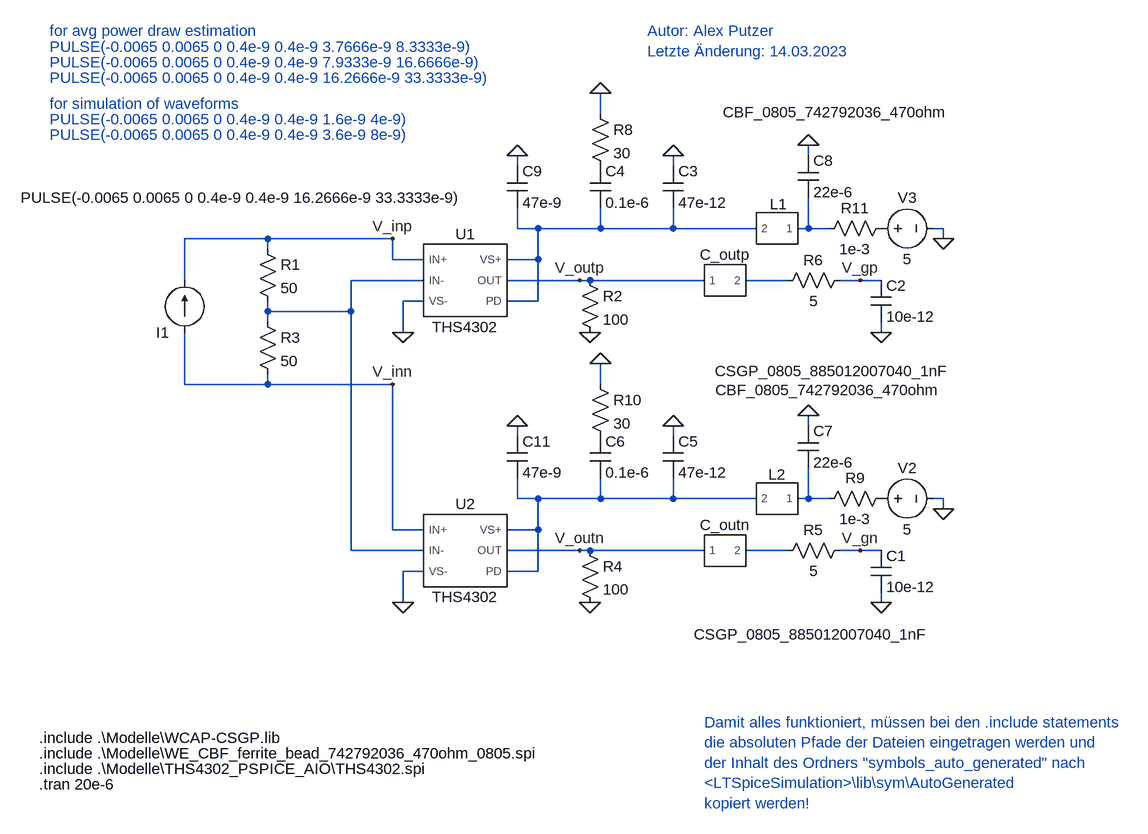
[diagram p0: schematic Eingangsstufe_v1.1.asc]
Eingangsstufe_v1.1.asc, the LTspice schematic file:
Version 4
SHEET 1 3072 680
WIRE 544 -512 544 -544
WIRE 864 -448 864 -464
WIRE 416 -432 416 -448
WIRE 656 -432 656 -448
WIRE 416 -336 416 -368
WIRE 448 -336 416 -336
WIRE 544 -336 544 -368
WIRE 544 -336 448 -336
WIRE 656 -336 656 -368
WIRE 656 -336 544 -336
WIRE 784 -336 656 -336
WIRE 864 -336 864 -384
WIRE 864 -336 848 -336
WIRE 896 -336 864 -336
WIRE 1072 -336 1056 -336
WIRE 32 -320 -96 -320
WIRE 224 -320 32 -320
WIRE 1072 -320 1072 -336
WIRE 32 -304 32 -320
WIRE 224 -288 224 -320
WIRE 272 -288 224 -288
WIRE 448 -288 448 -336
WIRE 448 -288 400 -288
WIRE -96 -256 -96 -320
WIRE 272 -256 160 -256
WIRE 512 -256 400 -256
WIRE 528 -256 512 -256
WIRE 704 -256 528 -256
WIRE 832 -256 768 -256
WIRE 944 -256 912 -256
WIRE 976 -256 944 -256
WIRE 272 -224 240 -224
WIRE 448 -224 448 -288
WIRE 448 -224 400 -224
WIRE 32 -208 32 -224
WIRE 160 -208 160 -256
WIRE 160 -208 32 -208
WIRE 32 -192 32 -208
WIRE 240 -176 240 -224
WIRE 976 -176 976 -192
WIRE -96 -96 -96 -176
WIRE 32 -96 32 -112
WIRE 32 -96 -96 -96
WIRE 224 -96 32 -96
WIRE 544 -96 544 -128
WIRE 864 -32 864 -48
WIRE 416 -16 416 -32
WIRE 656 -16 656 -32
WIRE 416 80 416 48
WIRE 448 80 416 80
WIRE 544 80 544 48
WIRE 544 80 448 80
WIRE 656 80 656 48
WIRE 656 80 544 80
WIRE 784 80 656 80
WIRE 864 80 864 32
WIRE 864 80 848 80
WIRE 896 80 864 80
WIRE 1072 80 1056 80
WIRE 1072 96 1072 80
WIRE 224 128 224 -96
WIRE 272 128 224 128
WIRE 448 128 448 80
WIRE 448 128 400 128
WIRE 160 160 160 -208
WIRE 272 160 160 160
WIRE 512 160 400 160
WIRE 528 160 512 160
WIRE 704 160 528 160
WIRE 832 160 768 160
WIRE 944 160 912 160
WIRE 976 160 944 160
WIRE 272 192 240 192
WIRE 448 192 448 128
WIRE 448 192 400 192
WIRE 240 240 240 192
WIRE 976 240 976 224
FLAG 240 -176 0
FLAG 528 -176 0
FLAG 240 240 0
FLAG 528 240 0
FLAG 512 -256 V_outp
FLAG 512 160 V_outn
FLAG 224 -320 V_inp
FLAG 224 -96 V_inn
FLAG 976 240 0
FLAG 976 -176 0
FLAG 544 -544 0
FLAG 656 -448 0
FLAG 1072 96 0
FLAG 544 -128 0
FLAG 656 -32 0
FLAG 864 -48 0
FLAG 1072 -320 0
FLAG 864 -464 0
FLAG 416 -448 0
FLAG 416 -32 0
FLAG 944 160 V_gn
FLAG 944 -256 V_gp
SYMBOL AutoGenerated\\THS4302 336 -256 R0
SYMATTR InstName U1
SYMBOL current -96 -176 R180
WINDOW 3 -437 207 Left 2
WINDOW 123 0 0 Left 0
WINDOW 39 0 0 Left 0
SYMATTR Value PULSE(-0.0065 0.0065 0 0.4e-9 0.4e-9 16.2666e-9 33.3333e-9)
SYMATTR InstName I1
SYMBOL res 16 -320 R0
SYMATTR InstName R1
SYMATTR Value 50
SYMBOL res 512 -272 R0
SYMATTR InstName R2
SYMATTR Value 100
SYMBOL res 16 -208 R0
SYMATTR InstName R3
SYMATTR Value 50
SYMBOL AutoGenerated\\THS4302 336 160 R0
SYMATTR InstName U2
SYMBOL res 512 144 R0
SYMATTR InstName R4
SYMATTR Value 100
SYMBOL res 928 144 R90
WINDOW 0 0 56 VBottom 2
WINDOW 3 32 56 VTop 2
SYMATTR InstName R5
SYMATTR Value 5
SYMBOL cap 960 160 R0
SYMATTR InstName C1
SYMATTR Value 10e-12
SYMBOL res 928 -272 R90
WINDOW 0 0 56 VBottom 2
WINDOW 3 32 56 VTop 2
SYMATTR InstName R6
SYMATTR Value 5
SYMBOL cap 960 -256 R0
SYMATTR InstName C2
SYMATTR Value 10e-12
SYMBOL cap 640 -432 R0
SYMATTR InstName C3
SYMATTR Value 47e-12
SYMBOL cap 528 -432 R0
SYMATTR InstName C4
SYMATTR Value 0.1e-6
SYMBOL res 528 -528 R0
SYMATTR InstName R8
SYMATTR Value 30
SYMBOL voltage 960 80 R270
WINDOW 0 32 56 VTop 2
WINDOW 3 -32 56 VBottom 2
WINDOW 123 0 0 Left 0
WINDOW 39 0 0 Left 0
SYMATTR InstName V2
SYMATTR Value 5
SYMBOL res 992 64 R90
WINDOW 0 0 56 VBottom 2
WINDOW 3 32 56 VTop 2
SYMATTR InstName R9
SYMATTR Value 1e-3
SYMBOL cap 640 -16 R0
SYMATTR InstName C5
SYMATTR Value 47e-12
SYMBOL cap 528 -16 R0
SYMATTR InstName C6
SYMATTR Value 0.1e-6
SYMBOL res 528 -112 R0
SYMATTR InstName R10
SYMATTR Value 30
SYMBOL AutoGenerated\\CBF_0805_742792036_470ohm 816 80 R180
WINDOW 3 -81 152 Top 2
WINDOW 0 0 53 Bottom 2
SYMATTR InstName L2
SYMBOL cap 848 -32 R0
SYMATTR InstName C7
SYMATTR Value 22e-6
SYMBOL voltage 960 -336 R270
WINDOW 0 32 56 VTop 2
WINDOW 3 -32 56 VBottom 2
WINDOW 123 0 0 Left 0
WINDOW 39 0 0 Left 0
SYMATTR InstName V3
SYMATTR Value 5
SYMBOL res 992 -352 R90
WINDOW 0 0 56 VBottom 2
WINDOW 3 32 56 VTop 2
SYMATTR InstName R11
SYMATTR Value 1e-3
SYMBOL AutoGenerated\\CBF_0805_742792036_470ohm 816 -336 R180
WINDOW 3 -92 163 Top 2
WINDOW 0 -2 53 Bottom 2
SYMATTR InstName L1
SYMBOL cap 848 -448 R0
SYMATTR InstName C8
SYMATTR Value 22e-6
SYMBOL cap 400 -432 R0
SYMATTR InstName C9
SYMATTR Value 47e-9
SYMBOL cap 400 -16 R0
SYMATTR InstName C11
SYMATTR Value 47e-9
SYMBOL AutoGenerated\\CSGP_0805_885012007040_1nF 736 160 R0
WINDOW 3 167 -292 Top 2
SYMATTR InstName C_outn
SYMBOL AutoGenerated\\CSGP_0805_885012007040_1nF 736 -256 R0
WINDOW 3 135 529 Top 2
SYMATTR InstName C_outp
TEXT -320 496 Left 2 !.include .\\Modelle\\THS4302_PSPICE_AIO\\THS4302.spi
TEXT -320 520 Left 2 !.tran 20e-6
TEXT -320 472 Left 2 !.include .\\Modelle\\WE_CBF_ferrite_bead_742792036_470ohm_0805.spi
TEXT -320 448 Left 2 !.include .\\Modelle\\WCAP-CSGP.lib
TEXT -304 -504 Left 2 ;PULSE(-0.0065 0.0065 0 0.4e-9 0.4e-9 1.6e-9 4e-9)
TEXT -304 -640 Left 2 ;for avg power draw estimation
TEXT -304 -528 Left 2 ;for simulation of waveforms
TEXT -304 -480 Left 2 ;PULSE(-0.0065 0.0065 0 0.4e-9 0.4e-9 3.6e-9 8e-9)
TEXT -304 -616 Left 2 ;PULSE(-0.0065 0.0065 0 0.4e-9 0.4e-9 3.7666e-9 8.3333e-9)
TEXT -304 -592 Left 2 ;PULSE(-0.0065 0.0065 0 0.4e-9 0.4e-9 7.9333e-9 16.6666e-9)
TEXT -304 -568 Left 2 ;PULSE(-0.0065 0.0065 0 0.4e-9 0.4e-9 16.2666e-9 33.3333e-9)
TEXT 704 424 Left 2 ;Damit alles funktioniert, müssen bei den .include statements \ndie absoluten Pfade der Dateien eingetragen werden und \nder Inhalt des Ordners "symbols_auto_generated" nach \n<LTSpiceSimulation>\\lib\\sym\\AutoGenerated \nkopiert werden!
TEXT 616 -640 Left 2 ;Autor: Alex Putzer\nLetzte Änderung: 14.03.2023

The netlist it stands for:
* Eingangsstufe_v1.1.asc
XU1 V_inp N003 N001 0 V_outp N001 THS4302  ; pins IN+ IN- VS+ VS- OUT PD
I1 V_inn V_inp PULSE(-0.0065 0.0065 0 0.4e-9 0.4e-9 16.2666e-9 33.3333e-9)
R1 V_inp N003 50
R2 V_outp 0 100
R3 N003 V_inn 50
XU2 V_inn N003 N005 0 V_outn N005 THS4302  ; pins IN+ IN- VS+ VS- OUT PD
R4 V_outn 0 100
R5 V_gn N007 5
C1 V_gn 0 10e-12
R6 V_gp N004 5
C2 V_gp 0 10e-12
C3 0 N001 47e-12
C4 P001 N001 0.1e-6
R8 0 P001 30
V2 P002 0 5
R9 P002 N006 1e-3
C5 0 N005 47e-12
C6 P003 N005 0.1e-6
R10 0 P003 30
XL2 N006 N005 CBF_0805_742792036_470ohm  ; pins 1 2
C7 0 N006 22e-6
V3 P004 0 5
R11 P004 N002 1e-3
XL1 N002 N001 CBF_0805_742792036_470ohm  ; pins 1 2
C8 0 N002 22e-6
C9 0 N001 47e-9
C11 0 N005 47e-9
XC_outn V_outn N007 CSGP_0805_885012007040_1nF  ; pins 1 2
XC_outp V_outp N004 CSGP_0805_885012007040_1nF  ; pins 1 2
.include .\Modelle\THS4302_PSPICE_AIO\THS4302.spi
.tran 20e-6
.include .\Modelle\WE_CBF_ferrite_bead_742792036_470ohm_0805.spi
.include .\Modelle\WCAP-CSGP.lib
* PULSE(-0.0065 0.0065 0 0.4e-9 0.4e-9 1.6e-9 4e-9)
* for avg power draw estimation
* for simulation of waveforms
* PULSE(-0.0065 0.0065 0 0.4e-9 0.4e-9 3.6e-9 8e-9)
* PULSE(-0.0065 0.0065 0 0.4e-9 0.4e-9 3.7666e-9 8.3333e-9)
* PULSE(-0.0065 0.0065 0 0.4e-9 0.4e-9 7.9333e-9 16.6666e-9)
* PULSE(-0.0065 0.0065 0 0.4e-9 0.4e-9 16.2666e-9 33.3333e-9)
* Damit alles funktioniert, müssen bei den .include statements
* die absoluten Pfade der Dateien eingetragen werden und
* der Inhalt des Ordners "symbols_auto_generated" nach
* <LTSpiceSimulation>\lib\sym\AutoGenerated
* kopiert werden!
* Autor: Alex Putzer
* Letzte Änderung: 14.03.2023
.lib C:\Users\studm\Desktop\week07.03.22folders\Masterarbeit\EndstufeV2Daten\THS4302_PSPICE_AIO\THS4302.spi
.lib C:\Users\studm\Desktop\week07.03.22folders\Masterarbeit\EndstufeV2Daten\WE_CBF_ferrite_bead_742792036_470ohm_0805.spi
.lib C:\Users\studm\Desktop\week07.03.22folders\Masterarbeit\MasterarbeitAustauschordner\qucsFiles\cmcdDriver_prj\Modelle\Kondensatoren\Wuerth_MLCC_WCAP_CSGP\WCAP-CSGP.lib
.backanno
.end